# Altium schematic sheet BANK_2.SchDoc
size A4
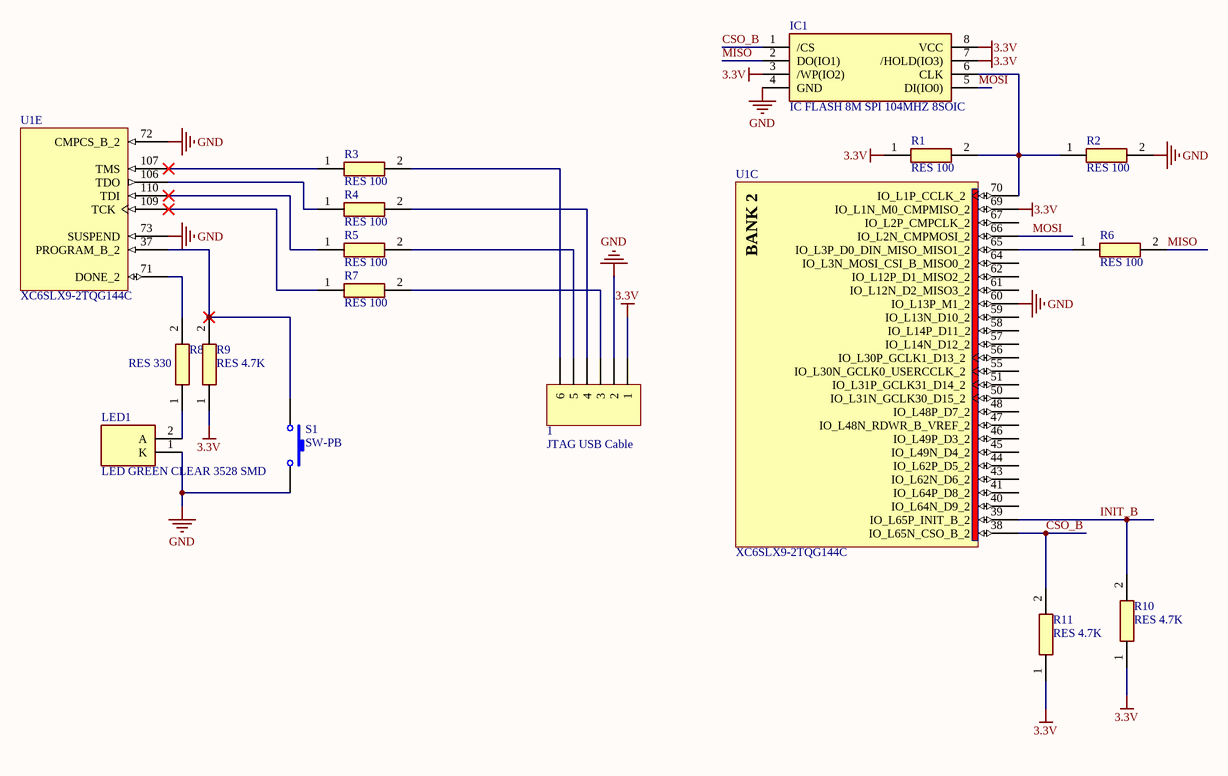
[diagram p0: BANK_2.SchDoc]

## Parts
1  JTAG USB Cable  [HDR1X6]
IC1  IC FLASH 8M SPI 104MHZ 8SOIC  [SOIC127P790X216-8N]
LED1  LED GREEN CLEAR 3528 SMD  [LEDM3528X210N]
R1  RES 100  [RESC2012X65N]
R2  RES 100  [RESC2012X65N]
R3  RES 100  [RESC2012X65N]
R4  RES 100  [RESC2012X65N]
R5  RES 100  [RESC2012X65N]
R6  RES 100  [RESC2012X65N]
R7  RES 100  [RESC2012X65N]
R8  RES 330  [RESC2012X65N]
R9  RES 4.7K  [RESC2012X60N]
R10  RES 4.7K  [RESC2012X60N]
R11  RES 4.7K  [RESC2012X60N]
S1  SW-PB  [SPST-2]
U1  XC6SLX9-2TQG144C  [TQG144_N]  (parts C,E of 7)

## Nets
3.3V: 1.1 IC1.3(/WP(IO2)) IC1.7(/HOLD(IO3)) IC1.8(VCC) R1.1 R9.1 R10.1 R11.1 U1.69(IO_L1N_M0_CMPMISO_2)
GND: 1.2 IC1.4(GND) LED1.1(K) R2.2 S1.2 U1.60(IO_L13P_M1_2) U1.72(CMPCS_B_2) U1.73(SUSPEND)
CSO_B: IC1.1(/CS) R11.2 U1.38(IO_L65N_CSO_B_2)
INIT_B: R10.2 U1.39(IO_L65P_INIT_B_2)
MISO: IC1.2(DO(IO1)) R6.2
MOSI: IC1.5(DI(IO0)) U1.66(IO_L2N_CMPMOSI_2)
Net1_3: 1.3 R7.2
Net1_4: 1.4 R4.2
Net1_5: 1.5 R5.2
Net1_6: 1.6 R3.2
NetIC1_6: IC1.6(CLK) R1.2 R2.1 U1.70(IO_L1P_CCLK_2)
NetLED1_2: LED1.2(A) R8.1
NetR3_1: R3.1 U1.107(TMS)
NetR4_1: R4.1 U1.106(TDO)
NetR5_1: R5.1 U1.110(TDI)
NetR6_1: R6.1 U1.65(IO_L3P_D0_DIN_MISO_MISO1_2)
NetR7_1: R7.1 U1.109(TCK)
NetR8_2: R8.2 U1.71(DONE_2)
NetR9_2: R9.2 S1.1 U1.37(PROGRAM_B_2)

Not connected (* = marked no-connect by the designer): U1 40(IO_L64N_D9_2) 41(IO_L64P_D8_2) 43(IO_L62N_D6_2) 44(IO_L62P_D5_2) 45(IO_L49N_D4_2) 46(IO_L49P_D3_2) 47(IO_L48N_RDWR_B_VREF_2) 48(IO_L48P_D7_2) 50(IO_L31N_GCLK30_D15_2) 51(IO_L31P_GCLK31_D14_2) 55(IO_L30N_GCLK0_USERCCLK_2) 56(IO_L30P_GCLK1_D13_2) 57(IO_L14N_D12_2) 58(IO_L14P_D11_2) 59(IO_L13N_D10_2) 61(IO_L12N_D2_MISO3_2) 62(IO_L12P_D1_MISO2_2) 64(IO_L3N_MOSI_CSI_B_MISO0_2) 67(IO_L2P_CMPCLK_2)

## Notes on the sheet
- (in symbol XC6SLX9-2TQG144C, part C) BANK 2

## Library data of the parts
1 = JTAG USB Cable: DIGILENT         250-003            PROGRAMMING CABLE, JTAG TO USB; Supplier 1: Digi-Key; Manufacturer: Digilent; Manufacturer Part Number: 250-003; Stock 1: 33; Pricing 1: 1=59 (USD); Number of Pins: 6; Package Quantity: 1; REACH SVHC: No SVHC; ComponentLink1URL: http://www.digilentinc.com/Data/Products/JTAG-USB/JTAG-USB%20Cable_rm.pdf?src-supplier=Digi-Key; ComponentLink1Description: http://www.digilentinc.com/Data/Products/JTAG-USB/JTAG-USB%20Cable_rm.pdf?src-supplier=Digi-Key; Category: Programmers; Supplier Part Number 1: 1286-1052-ND
IC1 = IC FLASH 8M SPI 104MHZ 8SOIC: Integrated Circuit; Manufacturer_Name: Winbond; Manufacturer_Part_Number: W25Q80DVSSIG; Datasheet Link: https://www.winbond.com/resource-files/w25q80dv_revf_02112015.pdf; Height: 2.16mm; Mouser Part Number: 454-W25Q80DVSSIG; Mouser Price/Stock: https://www.mouser.com/Search/Refine.aspx?Keyword=454-W25Q80DVSSIG; RS Part Number: 1882614P; RS Price/Stock: http://uk.rs-online.com/web/p/products/1882614P
LED1 = LED GREEN CLEAR 3528 SMD: LED; Manufacturer_Name: Wurth Elektronik; Manufacturer_Part_Number: 150141GS73100; Datasheet Link: https://www.mouser.com/datasheet/2/445/150141GS73100-368683.pdf; Height: 2.1mm; Mouser Part Number: 710-150141GS73100; Mouser Price/Stock: https://www.mouser.com/Search/Refine.aspx?Keyword=710-150141GS73100; RS Part Number: 8154316P; RS Price/Stock: http://uk.rs-online.com/web/p/products/8154316P
R1-R7 = RES SMD 100 OHM 5% 1/8W 0805: Resistor; Manufacturer_Name: TE Connectivity; Manufacturer_Part_Number: CRG0805J100R; Datasheet Link: http://www.te.com/commerce/DocumentDelivery/DDEController?Action=showdoc&DocId=Customer+Drawing%7F1623109%7FBA%7Fpdf%7FEnglish%7FENG_CD_1623109_BA.pdf%7F1623109-1; Height: 0.65mm; Mouser Part Number: 279-CRG0805J100R; Mouser Price/Stock: https://www.mouser.com/Search/Refine.aspx?Keyword=279-CRG0805J100R
R8 = RES SMD 330 OHM 1% 1/8W 0805: Resistor; Manufacturer_Name: TE Connectivity; Manufacturer_Part_Number: CRG0805F330R; Allied_Number: 70063207; Datasheet Link: http://www.te.com/commerce/DocumentDelivery/DDEController?Action=showdoc&DocId=Customer+Drawing%7F1623109%7FBA%7Fpdf%7FEnglish%7FENG_CD_1623109_BA.pdf%7F1623109-1; Height: 0.65mm; Mouser Part Number: 279-CRG0805F330R; Mouser Price/Stock: https://www.mouser.com/Search/Refine.aspx?Keyword=279-CRG0805F330R; RS Part Number: 2230354P; RS Price/Stock: http://uk.rs-online.com/web/p/products/2230354P; Allied Price/Stock: https://www.alliedelec.com/te-connectivity-crg0805f330r/70063207/
R9-R11 = RES SMD 4.7K OHM 1% 1/8W 0805: Resistor; Manufacturer_Name: YAGEO (PHYCOMP); Manufacturer_Part_Number: RC0805FR-074K7L; Datasheet Link: http://www.yageo.com/documents/recent/PYu-RC_Group_51_RoHS_L_10.pdf; Height: 0.6mm; Mouser Part Number: 603-RC0805FR-074K7L; Mouser Price/Stock: https://www.mouser.com/Search/Refine.aspx?Keyword=603-RC0805FR-074K7L; RS Part Number: 6181408; RS Price/Stock: http://uk.rs-online.com/web/p/products/6181408
S1 = SW-PB: Switch; Published: 24-Mar-1999; LatestRevisionDate: 17-Jul-2002; LatestRevisionNote: Re-released for DXP Platform.; PackageReference: SPST-2; Publisher: Altium Limited; PackageDescription: Switch; 2 Leads
U1 = XC6SLX9-2TQG144C: Spartan-6 LX 1.2V FPGA, 102 User I/Os, 144-Pin TQFP (0.5mm Pitch), Speed Grade 2, Commercial Grade, Pb-Free; DatasheetVersion: ver1.6, Nov-2010; PackageVersion: ver1.2, Jun-2004; PackageReference: TQG144; PackageDescription: 144-Pin Thin Quad Flat Pack (TQG144) - Pb-Free; Code_JEDEC: MS-026-BFB; ComponentLink1Description: Manufacturer URL; ComponentLink1URL: http://www.xilinx.com/; ComponentLink2Description: Spartan-6 Datasheet; ComponentLink2URL: http://www.xilinx.com/support/documentation/data_sheets/ds160.pdf; ComponentLink3Description: Spartan-6 Documents; ComponentLink3URL: http://www.xilinx.com/support/documentation/spartan-6.htm